# Altium schematic sheet CoverSheet.SchDoc
size 431 x 279 mm; Date: Not shown in title block; ApprovedBy: Not shown in title block; CheckedBy: Not shown in title block; Author: Not shown in title block; CompanyName: Not shown in title block; Engineer: Not shown in title block; Organization: Not shown in title block; Address1: Not shown in title block; Address2: Not shown in title block; Address3: Not shown in title block; Address4: Not shown in title block; DocumentNumber: 1; Revision: Use project parameter SCH_Rev; SheetNumber: 1; SheetTotal: 3; PageSetup: Record=PageOptions|CenterHorizontal=True|CenterVertical=True|PrintScale=1.00|XCorrection=1.00|YCorrection=1.00|PrintKind=0|BorderSize=5000000|LeftOffset=0|BottomOffset=0|Orientation=2|PaperLength=1000|PaperWidth=1000|Scale=100|PaperSource=15|PrintQuality=600|MediaType=1|DitherType=10|PaperKind=Letter|PrintScaleMode=1; CurrentTime: Not shown in title block; CurrentDate: Not shown in title block; Time: Not shown in title block; DocumentFullPathAndName: Not shown in title block; DocumentName: Not shown in title block; ModifiedDate: Not shown in title block; ImagePath: Not shown in title block
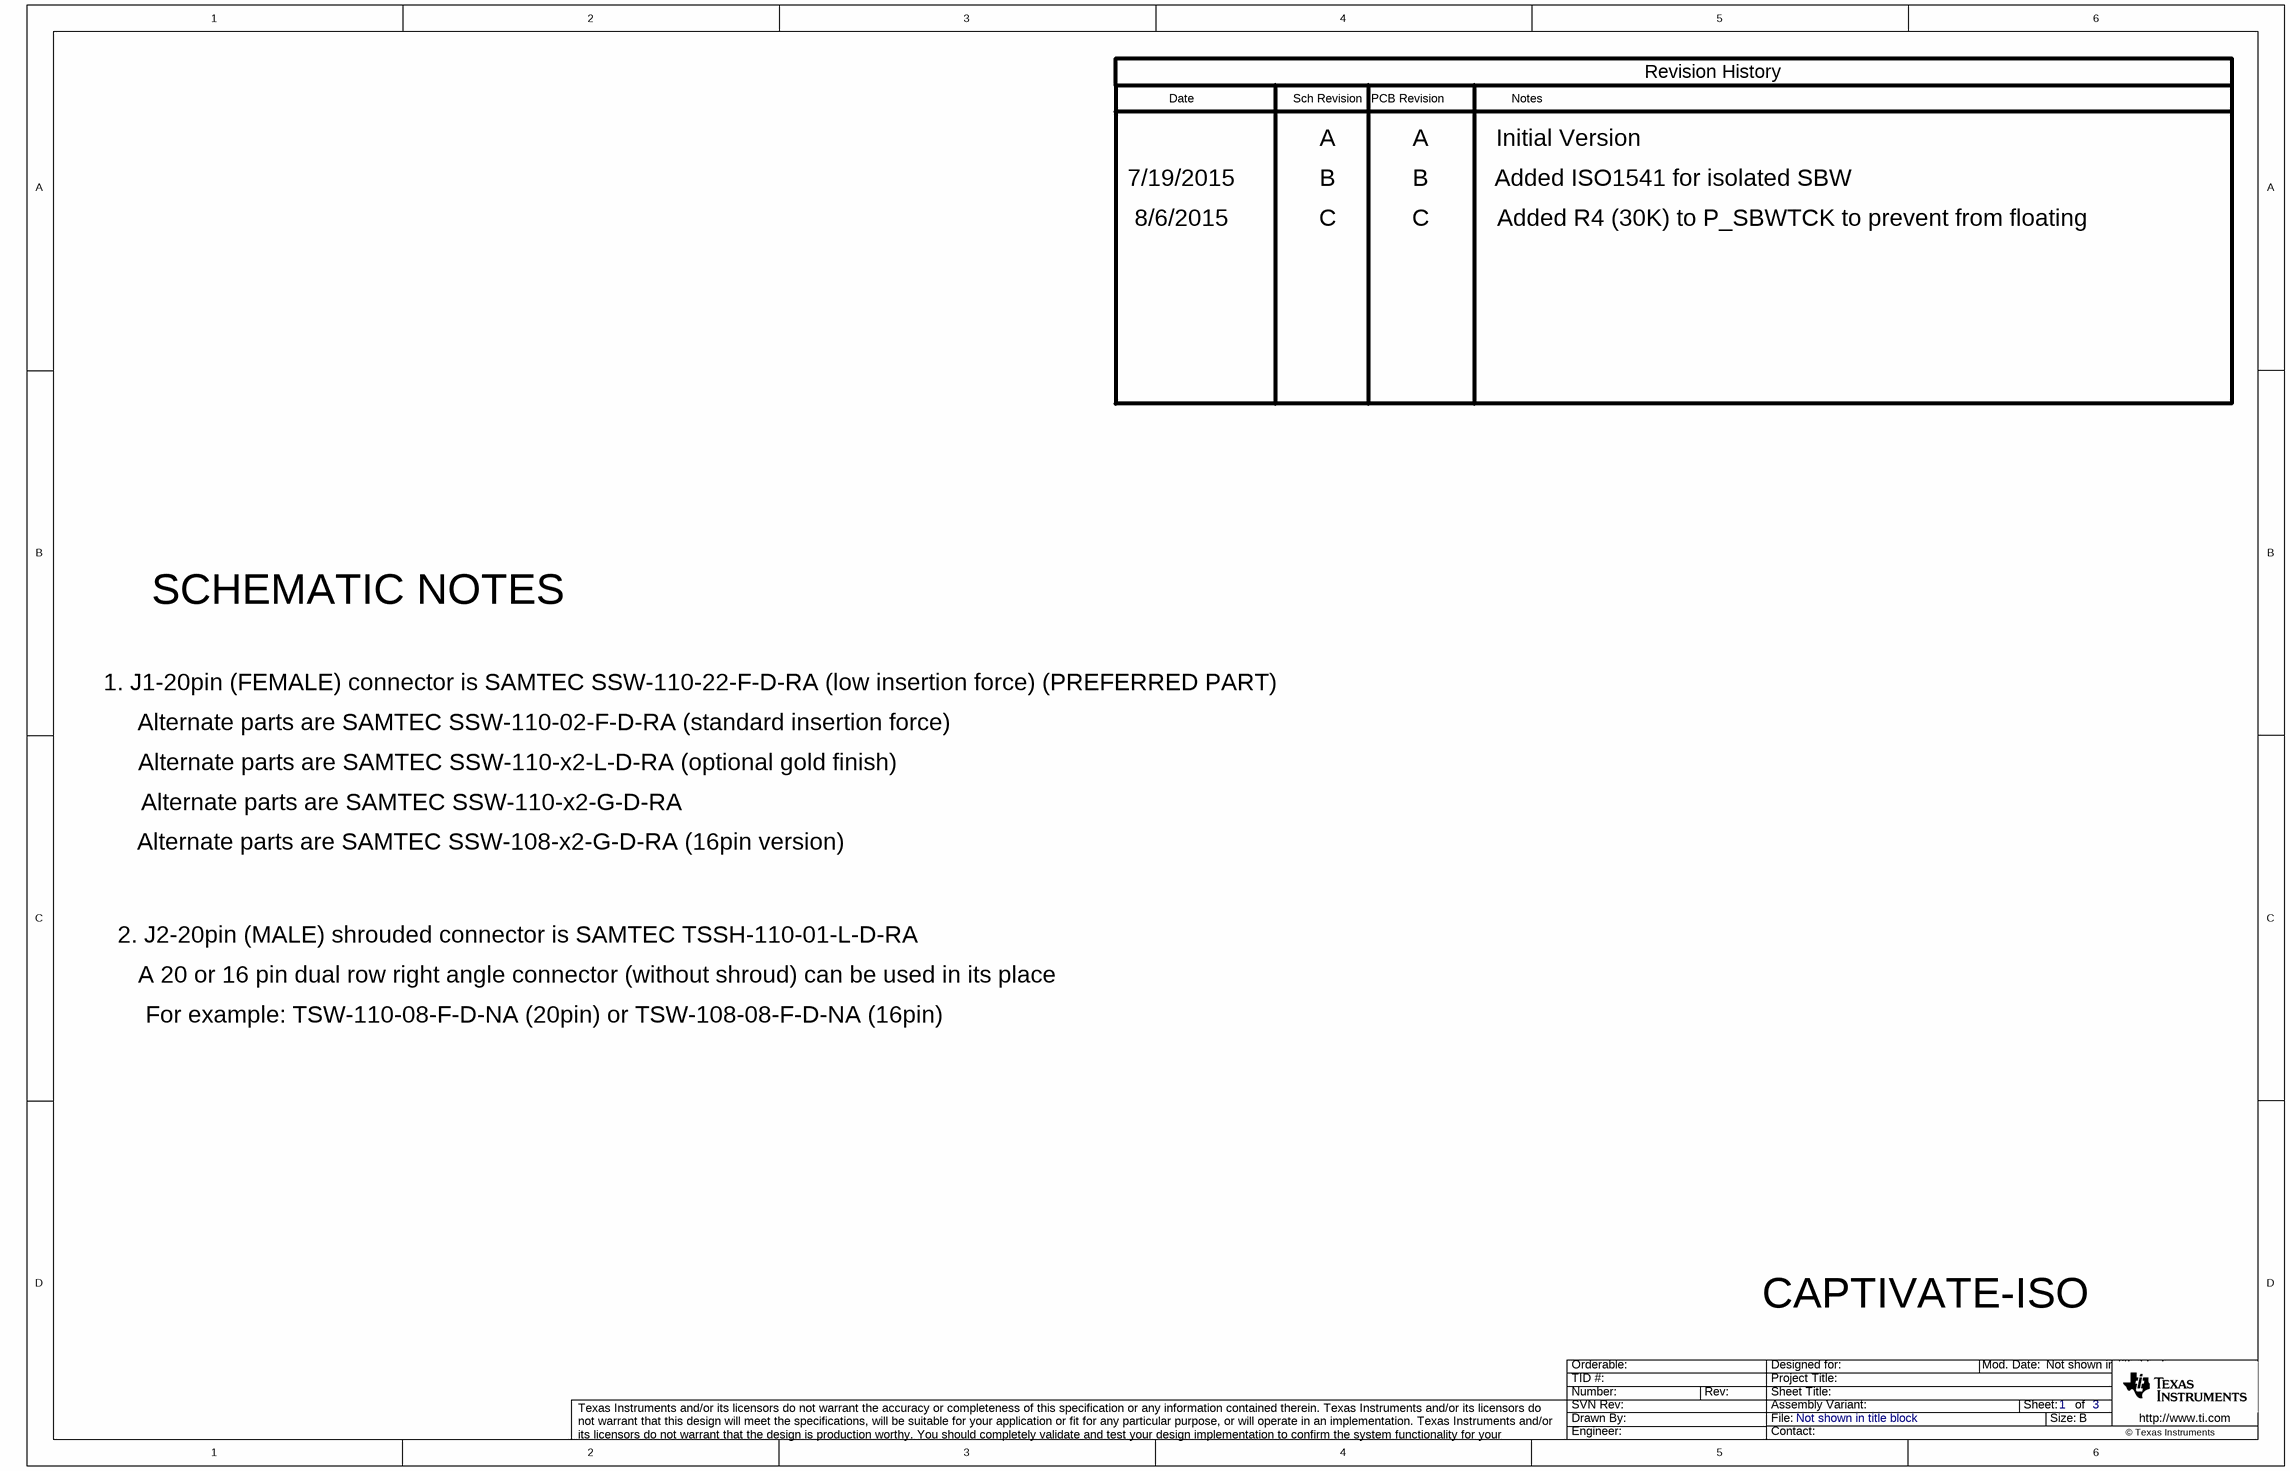
[diagram p0: CoverSheet.SchDoc]

## Notes on the sheet
- Date
- Sch Revision
- PCB Revision
- Notes
- Revision History
- A
- Initial Version
- 7/19/2015
- 8/6/2015
- B
- C
- Added ISO1541 for isolated SBW
- Added R4 (30K) to P_SBWTCK to prevent from floating
- SCHEMATIC NOTES
- 1. J1-20pin (FEMALE) connector is SAMTEC SSW-110-22-F-D-RA (low insertion force) (PREFERRED PART)
- Alternate parts are SAMTEC SSW-110-x2-L-D-RA (optional gold finish)
- Alternate parts are SAMTEC SSW-110-02-F-D-RA (standard insertion force)
- Alternate parts are SAMTEC SSW-110-x2-G-D-RA
- Alternate parts are SAMTEC SSW-108-x2-G-D-RA (16pin version)
- 2. J2-20pin (MALE) shrouded connector is SAMTEC TSSH-110-01-L-D-RA
- For example: TSW-110-08-F-D-NA (20pin) or TSW-108-08-F-D-NA (16pin)
- A 20 or 16 pin dual row right angle connector (without shroud) can be used in its place
- CAPTIVATE-ISO
- Drawn By:
- SVN Rev:
- Number:
- TID #:
- Orderable:
- Rev:
- Sheet Title:
- File:
- Project Title:
- Designed for:
- Assembly Variant:
- Mod. Date:
- Sheet:
- Size:
- of
- http://www.ti.com
- Texas Instruments and/or its licensors do not warrant the accuracy or completeness of this specification or any information contained therein. Texas Instruments and/or its licensors do not warrant that this design will meet the specifications, will be suitable for your application or fit for any particular purpose, or will operate in an implementation. Texas Instruments and/or its licensors do not warrant that the design is production worthy. You should completely validate and test your design implementation to confirm the system functionality for your application.
- Engineer:
- Contact:
- © Texas Instruments